# Altium schematic sheet DISCRETE_INPUT.SchDoc
size A4; SheetNumber: 11; SheetTotal: 13
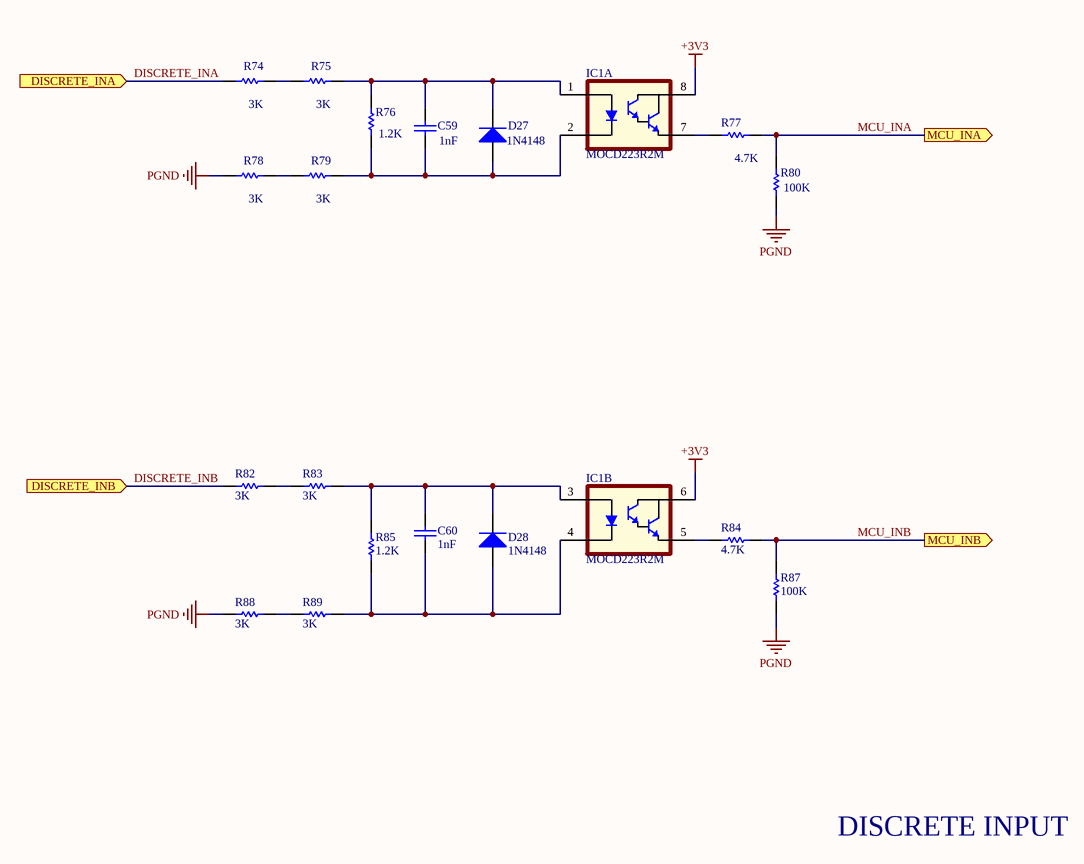
[diagram p0: DISCRETE_INPUT.SchDoc]

## Parts
C59  1nF  [C 0603(1608)x0.8_3]
C60  1nF  [C 0603(1608)x0.8_3]
D27  value 1N4148  [SOD123]  (hidden comment: DIODE 1N4148 GEN PURP 100V 150MA SOD123)
D28  value 1N4148  [SOD123]  (hidden comment: DIODE 1N4148 GEN PURP 100V 150MA SOD123)
IC1  MOCD223R2M  [SOIC127P600-8N]  (parts A,B of 2)
R74  3K  [R 0603(1608)]
R75  3K  [R 0603(1608)]
R76  1.2K  [R 0603(1608)]
R77  4.7K  [R 0603(1608)]
R78  3K  [R 0603(1608)]
R79  3K  [R 0603(1608)]
R80  100K  [R 0603(1608)]
R82  3K  [R 0603(1608)]
R83  3K  [R 0603(1608)]
R84  4.7K  [R 0603(1608)]
R85  1.2K  [R 0603(1608)]
R87  100K  [R 0603(1608)]
R88  3K  [R 0603(1608)]
R89  3K  [R 0603(1608)]

## Ports
DISCRETE_INA (in), DISCRETE_INB (in), MCU_INA (out), MCU_INB (out)

## Nets
+3V3: IC1.6 IC1.8
PGND: R78.1 R80.1 R87.1 R88.1
DISCRETE_INA: R74.1 ; port DISCRETE_INA
DISCRETE_INB: R82.1 ; port DISCRETE_INB
MCU_INA: R77.2 R80.2 ; port MCU_INA
MCU_INB: R84.2 R87.2 ; port MCU_INB
NetC59_1: C59.1 D27.1(A) IC1.2 R76.1 R79.2
NetC59_2: C59.2 D27.2(K) IC1.1 R75.2 R76.2
NetC60_1: C60.1 D28.1(A) IC1.4 R85.1 R89.2
NetC60_2: C60.2 D28.2(K) IC1.3 R83.2 R85.2
NetIC1_5: IC1.5 R84.1
NetIC1_7: IC1.7 R77.1
NetR74_2: R74.2 R75.1
NetR78_2: R78.2 R79.1
NetR82_2: R82.2 R83.1
NetR88_2: R88.2 R89.1

## Notes on the sheet
- DISCRETE INPUT

## Library data of the parts
C59 C60 = CAP CER 1NF 10% 2KV X7R SMD 1206: Cap Ceramic 0.001uF 50V X7R 10% SMD 0603 125C Paper T/R; Manufacturer: Murata; Manufacturer Part Number: GCM188R71H102KA37D; Supplier 1: Digi-Key; Supplier Part Number 1: 490-4777-1-ND; RoHS: Yes; Category: Ceramic Capacitors; Stock 1: 11039468; Pricing 1: 1=0,10000, 10=0,07100, 50=0,03900, 100=0,03180, 500=0,02272, 1000=0,01785 (USD); Mount: Surface Mount; Case/Package: 0603; Case Code (Imperial): 0603; Case Code (Metric): 1608; Min Operating Temperature: -55°C; Max Operating Temperature: 125°C; Capacitance: 1nF; Tolerance: 10%; Dielectric: X7R; Packaging: Tape and Reel; Voltage Rating: 50V; Voltage Rating (DC): 50V; Package Quantity: 4000; Termination: SMD/SMT; Voltage: 50V; Series: GCM; Construction: Flat; Length: 1.6mm; Width: 0.8mm; Height: 0.8mm; Thickness: 0.035inch; Depth: 0.8mm; Ratings: AEC-Q200; Radiation Hardening: No; REACH SVHC: No SVHC; Lead Free: Lead Free; RoHS Compliant: Yes; ComponentLink1URL: https://datasheet.ciiva.com/18183/getdatasheetpartid-310250-18183617.pdf?src-supplier=Verical; ComponentLink1Description: https://datasheet.ciiva.com/18183/getdatasheetpartid-310250-18183617.pdf?src-supplier=Verical; ComponentLink2URL: https://datasheet.ciiva.com/11787/0900766b80ef92d0-11787654.pdf?src-supplier=RSComponents; ComponentLink2Description: https://datasheet.ciiva.com/11787/0900766b80ef92d0-11787654.pdf?src-supplier=RSComponents; ComponentLink3URL: https://datasheet.ciiva.com/131/product-131993.pdf?src-supplier=Digi-Key; ComponentLink3Description: https://datasheet.ciiva.com/131/product-131993.pdf?src-supplier=Digi-Key; ComponentLink4URL: https://datasheet.ciiva.com/131/product-131994.pdf?src-supplier=Digi-Key; ComponentLink4Description: https://datasheet.ciiva.com/131/product-131994.pdf?src-supplier=Digi-Key; ComponentLink5URL: https://datasheet.ciiva.com/131/product-131995.pdf?src-supplier=Digi-Key; ComponentLink5Description: https://datasheet.ciiva.com/131/product-131995.pdf?src-supplier=Digi-Key; ComponentLink6URL: https://datasheet.ciiva.com/11621/product-11621654.pdf?src-supplier=Avnet; ComponentLink6Description: https://datasheet.ciiva.com/11621/product-11621654.pdf?src-supplier=Avnet; ComponentLink7URL: https://datasheet.ciiva.com/16624/product-16624559.pdf?src-supplier=Avnet+Europe; ComponentLink7Description: https://datasheet.ciiva.com/16624/product-16624559.pdf?src-supplier=Avnet+Europe
D27 D28 = DIODE 1N4148 GEN PURP 100V 150MA SOD123: Manufacturer: MICRO COMMERCIAL; Manufacturer Part Name: 1N4148W-TP; Code: 3040007; Family: DIODE; Package Reference: SOD123; Supplier: Digikey; Supplier No: 1N4148WTPMSTR-ND
IC1 = MOCD223R2M: IC OPTOISO DARLINGTON OUTPUT MOCD223R2M 2CH VCE 30V SOIC8; Manufacturer: FAIRCHILD; Code: 3000115; Family: IC; Manufacturer Part Name: MOCD223R2M; Supplier: Mouser; Supplier No: 512-MOCD223R2M; Package Reference: SOIC8; Value: MOCD223R2M
R74 R75 R78 R79 R82 R83 R88 R89 = RES CHIP 3K 1% 1/4W SMD 1206: RES SMD 3K OHM 1% 1/10W 0603; Manufacturer: Yageo; Manufacturer Part Number: RC0603FR-073KL; Resistance: 3kR; Power Rating: 100mW; Voltage Rating: 50V; Temperature Coefficient: 100ppm/°C; Supplier 1: Digi-Key; Supplier Part Number 1: 311-3.00KHRCT-ND; RoHS: Yes; Category: Chip SMD Resistors; Stock 1: 553763; Pricing 1: 1=0,10000, 10=0,02400, 100=0,00970, 1000=0,00436, 2500=0,00378 (USD); Case/Package: 0603; Number of Pins: 2; Case Code (Imperial): 0603; Case Code (Metric): 1608; Size Code: 0603; Min Operating Temperature: -55°C; Max Operating Temperature: 155°C; Tolerance: 1%; Packaging: Tape and Reel; Termination: SMD/SMT; Resistor Type: Thick Film; Voltage Rating (DC): 50V; Features: Moisture Resistant; Series: RC; Max Power Dissipation: 100mW; Number of Terminations: 2; Construction: Rectangular; Resistance Tolerance: 1%; Length: 1.6mm; Width: 800um; Depth: 0.8mm; REACH SVHC: No SVHC; Military Standard: Not; Lead Free: Lead Free; RoHS Compliant: Yes; ComponentLink1URL: http://components.arrow.com/part/dataview/0323_00200942?src-supplier=Arrow+Europe; ComponentLink1Description: http://components.arrow.com/part/dataview/0323_00200942?src-supplier=Arrow+Europe; ComponentLink2URL: http://www.mouser.com/ds/2/447/RC0603-272842.pdf?src-supplier=Mouser; ComponentLink2Description: http://www.mouser.com/ds/2/447/RC0603-272842.pdf?src-supplier=Mouser; ComponentLink3URL: http://www.farnell.com/datasheets/2167052.pdf?src-supplier=Farnell; ComponentLink3Description: http://www.farnell.com/datasheets/2167052.pdf?src-supplier=Farnell; ComponentLink4URL: https://www.verical.com/server-webapp/html/getDatasheet?partID=135099&src-supplier=Verical; ComponentLink4Description: https://www.verical.com/server-webapp/html/getDatasheet?partID=135099&src-supplier=Verical; ComponentLink5URL: http://www.farnell.com/datasheets/2167052.pdf?src-supplier=Element14; ComponentLink5Description: http://www.farnell.com/datasheets/2167052.pdf?src-supplier=Element14; ComponentLink6URL: http://www.farnell.com/datasheets/1868787.pdf?src-supplier=Newark; ComponentLink6Description: http://www.farnell.com/datasheets/1868787.pdf?src-supplier=Newark; ComponentLink7URL: http://www.yageo.com/documents/recent/PYu-RC0603_51_RoHS_L_7.pdf?src-supplier=Future+Electronics; ComponentLink7Description: http://www.yageo.com/documents/recent/PYu-RC0603_51_RoHS_L_7.pdf?src-supplier=Future+Electronics; ComponentLink8URL: http://www.yageo.com/documents/recent/PYu-RC_Group_51_RoHS_L_9.pdf?src-supplier=Digi-Key; ComponentLink8Description: http://www.yageo.com/documents/recent/PYu-RC_Group_51_RoHS_L_9.pdf?src-supplier=Digi-Key; ComponentLink9URL: http://www.yageo.com/documents/recent/PYu-RC_Group_51_RoHS_L_10.pdf?src-supplier=Digi-Key; ComponentLink9Description: http://www.yageo.com/documents/recent/PYu-RC_Group_51_RoHS_L_10.pdf?src-supplier=Digi-Key
R76 R85 = RES CHIP 1K2 5% 1/4W SMD 1206: RES SMD 1.2K OHM 1% 1/10W 0603; Manufacturer: Vishay; Manufacturer Part Number: CRCW06031K20FKEA; Resistance: 1.2kR; Power Rating: 100mW; Voltage Rating: 75V; Temperature Coefficient: 100ppm/°C; Supplier 1: Digi-Key; Supplier Part Number 1: 541-1.20KHCT-ND; RoHS: Yes; Category: Chip SMD Resistors; Stock 1: 4565; Pricing 1: 1=0,10000, 10=0,03800, 100=0,01560, 1000=0,00701, 2500=0,00608 (USD); Mount: Surface Mount; Case/Package: 0603; Weight: 7.1E-05oz; Case Code (Metric): 1608; Case Code (Imperial): 0603; Contact Plating: Tin; Size Code: 0603; Min Operating Temperature: -55°C; Max Operating Temperature: 155°C; Tolerance: 1%; Package Quantity: 10; Packaging: Tape and Reel; Resistor Type: Thick Film; Number of Terminations: 2; Termination: SMD/SMT; Max Power Dissipation: 100mW; Voltage Rating (DC): 75V; Features: Automotive AEC-Q200; Series: CRCW; Technology: THICK FILM; Construction: Rectangular; Resistance Tolerance: 1%; Length: 1.55mm; Width: 0.033inch; Height: 0.45mm; Depth: 0.85mm; Radiation Hardening: No; Lead Free: Lead Free; RoHS Compliant: Yes; REACH SVHC: Unknown; Military Standard: Not; ComponentLink1URL: https://datasheet.ciiva.com/11811/0900766b80d98afc-11811521.pdf?src-supplier=RSComponents; ComponentLink1Description: https://datasheet.ciiva.com/11811/0900766b80d98afc-11811521.pdf?src-supplier=RSComponents; ComponentLink2URL: https://datasheet.ciiva.com/2466/dcrcwe3-2466208.pdf?src-supplier=Digi-Key; ComponentLink2Description: https://datasheet.ciiva.com/2466/dcrcwe3-2466208.pdf?src-supplier=Digi-Key; ComponentLink3URL: https://datasheet.ciiva.com/16778/70201119-16778936.pdf?src-supplier=Allied+Electronics; ComponentLink3Description: https://datasheet.ciiva.com/16778/70201119-16778936.pdf?src-supplier=Allied+Electronics; ComponentLink4URL: https://datasheet.ciiva.com/22871/70201119-22871945.pdf?src-supplier=Allied+Electronics; ComponentLink4Description: https://datasheet.ciiva.com/22871/70201119-22871945.pdf?src-supplier=Allied+Electronics; ComponentLink5URL: https://datasheet.ciiva.com/26316/fld-crcw-e3-data-en-26316553.pdf?src-supplier=Distrelec; ComponentLink5Description: https://datasheet.ciiva.com/26316/fld-crcw-e3-data-en-26316553.pdf?src-supplier=Distrelec; ComponentLink6URL: https://datasheet.ciiva.com/7777/1697337-7777291.pdf?src-supplier=Element14; ComponentLink6Description: https://datasheet.ciiva.com/7777/1697337-7777291.pdf?src-supplier=Element14; ComponentLink7URL: https://datasheet.ciiva.com/5562/dcrcwe3-109170-5562444.pdf?src-supplier=Mouser; ComponentLink7Description: https://datasheet.ciiva.com/5562/dcrcwe3-109170-5562444.pdf?src-supplier=Mouser; ComponentLink8URL: https://datasheet.ciiva.com/7777/1697337-7777549.pdf?src-supplier=Element14; ComponentLink8Description: https://datasheet.ciiva.com/7777/1697337-7777549.pdf?src-supplier=Element14; ComponentLink9URL: https://datasheet.ciiva.com/2466/dcrcwe3-2466206.pdf?src-supplier=Digi-Key; ComponentLink9Description: https://datasheet.ciiva.com/2466/dcrcwe3-2466206.pdf?src-supplier=Digi-Key; ComponentLink10URL: https://datasheet.ciiva.com/2466/dcrcwe3-2466207.pdf?src-supplier=Digi-Key; ComponentLink10Description: https://datasheet.ciiva.com/2466/dcrcwe3-2466207.pdf?src-supplier=Digi-Key
R77 R84 = RES CHIP 4K7 5% 1/16W SMD 0402: RES SMD 4.7K OHM 1% 1/10W 0603; Manufacturer: Yageo; Manufacturer Part Number: RC0603FR-074K7L; Resistance: 4.7kR; Temperature Coefficient: 100ppm/°C; Power Rating: 100mW; Voltage Rating (DC): 50V; Supplier 1: Digi-Key; Supplier Part Number 1: 311-4.70KHRCT-ND; RoHS: Yes; Category: Chip SMD Resistors; Stock 1: 3053433; Pricing 1: 1=0,10000, 10=0,02400, 100=0,00970, 1000=0,00436, 2500=0,00378 (USD); Case/Package: 0603; Number of Pins: 2; Case Code (Imperial): 0603; Case Code (Metric): 1608; Size Code: 0603; Min Operating Temperature: -55°C; Max Operating Temperature: 155°C; Tolerance: 1%; Resistor Type: Thick Film; Packaging: Tape and Reel; Voltage Rating: 50V; Termination: SMD/SMT; Features: Moisture Resistant; Series: RC; Max Power Dissipation: 100mW; Number of Terminations: 2; Construction: Rectangular; Resistance Tolerance: 1%; Length: 1.6mm; Width: 0.8mm; Height: 0.45mm; Depth: 0.8mm; Lead Pitch: 0.3mm; REACH SVHC: No SVHC; Lead Free: Lead Free; RoHS Compliant: Yes; Military Standard: Not; ComponentLink1URL: https://datasheet.ciiva.com/15189/getdatasheetpartid-422754-15189760.pdf?src-supplier=Verical; ComponentLink1Description: https://datasheet.ciiva.com/15189/getdatasheetpartid-422754-15189760.pdf?src-supplier=Verical; ComponentLink2URL: https://datasheet.ciiva.com/22747/443971-22747528.pdf?src-supplier=Element14; ComponentLink2Description: https://datasheet.ciiva.com/22747/443971-22747528.pdf?src-supplier=Element14; ComponentLink3URL: https://datasheet.ciiva.com/7660/38590-7660794.pdf?src-supplier=Element14; ComponentLink3Description: https://datasheet.ciiva.com/7660/38590-7660794.pdf?src-supplier=Element14; ComponentLink4URL: https://datasheet.ciiva.com/7746/1868787-7746365.pdf?src-supplier=Element14; ComponentLink4Description: https://datasheet.ciiva.com/7746/1868787-7746365.pdf?src-supplier=Element14; ComponentLink5URL: https://datasheet.ciiva.com/46440/1868787-46440909.pdf?src-supplier=Element14; ComponentLink5Description: https://datasheet.ciiva.com/46440/1868787-46440909.pdf?src-supplier=Element14; ComponentLink6URL: https://datasheet.ciiva.com/7746/1738695-7746366.pdf?src-supplier=Element14; ComponentLink6Description: https://datasheet.ciiva.com/7746/1738695-7746366.pdf?src-supplier=Element14
R80 R87 = RES CHIP 100K 1% 1/16W SMD 0402: Res Thick Film 1.6 x 0.8 mm 100K Ohm 1% 0.1W(1/10W) 100ppm/ C Molded SMD Paper T/R; Manufacturer: Yageo; Manufacturer Part Number: RC0603FR-07100KL; Resistance: 100kR; Temperature Coefficient: 100ppm/°C; Voltage Rating (DC): 50V; Power Rating: 100mW; Working Voltage: 75V; Supplier 1: Digi-Key; Supplier Part Number 1: 311-100KHRCT-ND; RoHS: Yes; Category: Chip SMD Resistors; Stock 1: 10063121; Pricing 1: 1=0,10000, 10=0,02400, 100=0,00970, 1000=0,00436, 2500=0,00378 (USD); Case/Package: 0603; Number of Pins: 2; Case Code (Imperial): 0603; Case Code (Metric): 1608; Min Operating Temperature: -55°C; Max Operating Temperature: 155°C; Tolerance: 1%; Resistor Type: Thick Film; Packaging: Tape and Reel; Voltage Rating: 50V; Termination: SMD/SMT; Number of Terminations: 2; Features: Moisture Resistant; Series: RC; Max Power Dissipation: 100mW; Resistance Tolerance: 1%; Construction: Rectangular; Technology: THICK FILM; Length: 1.6mm; Width: 0.8mm; Height: 0.45mm; Depth: 0.8mm; REACH SVHC: No SVHC; Lead Free: Lead Free; Military Standard: Not; RoHS Compliant: Yes